# EasyEDA schematic ADS1293.json
TITLE: Sheet_1; REV: 1.0; Date: 2022-02-10; Sheet: 1/1; Drawn By: imamjheimam27; Company: Your Company
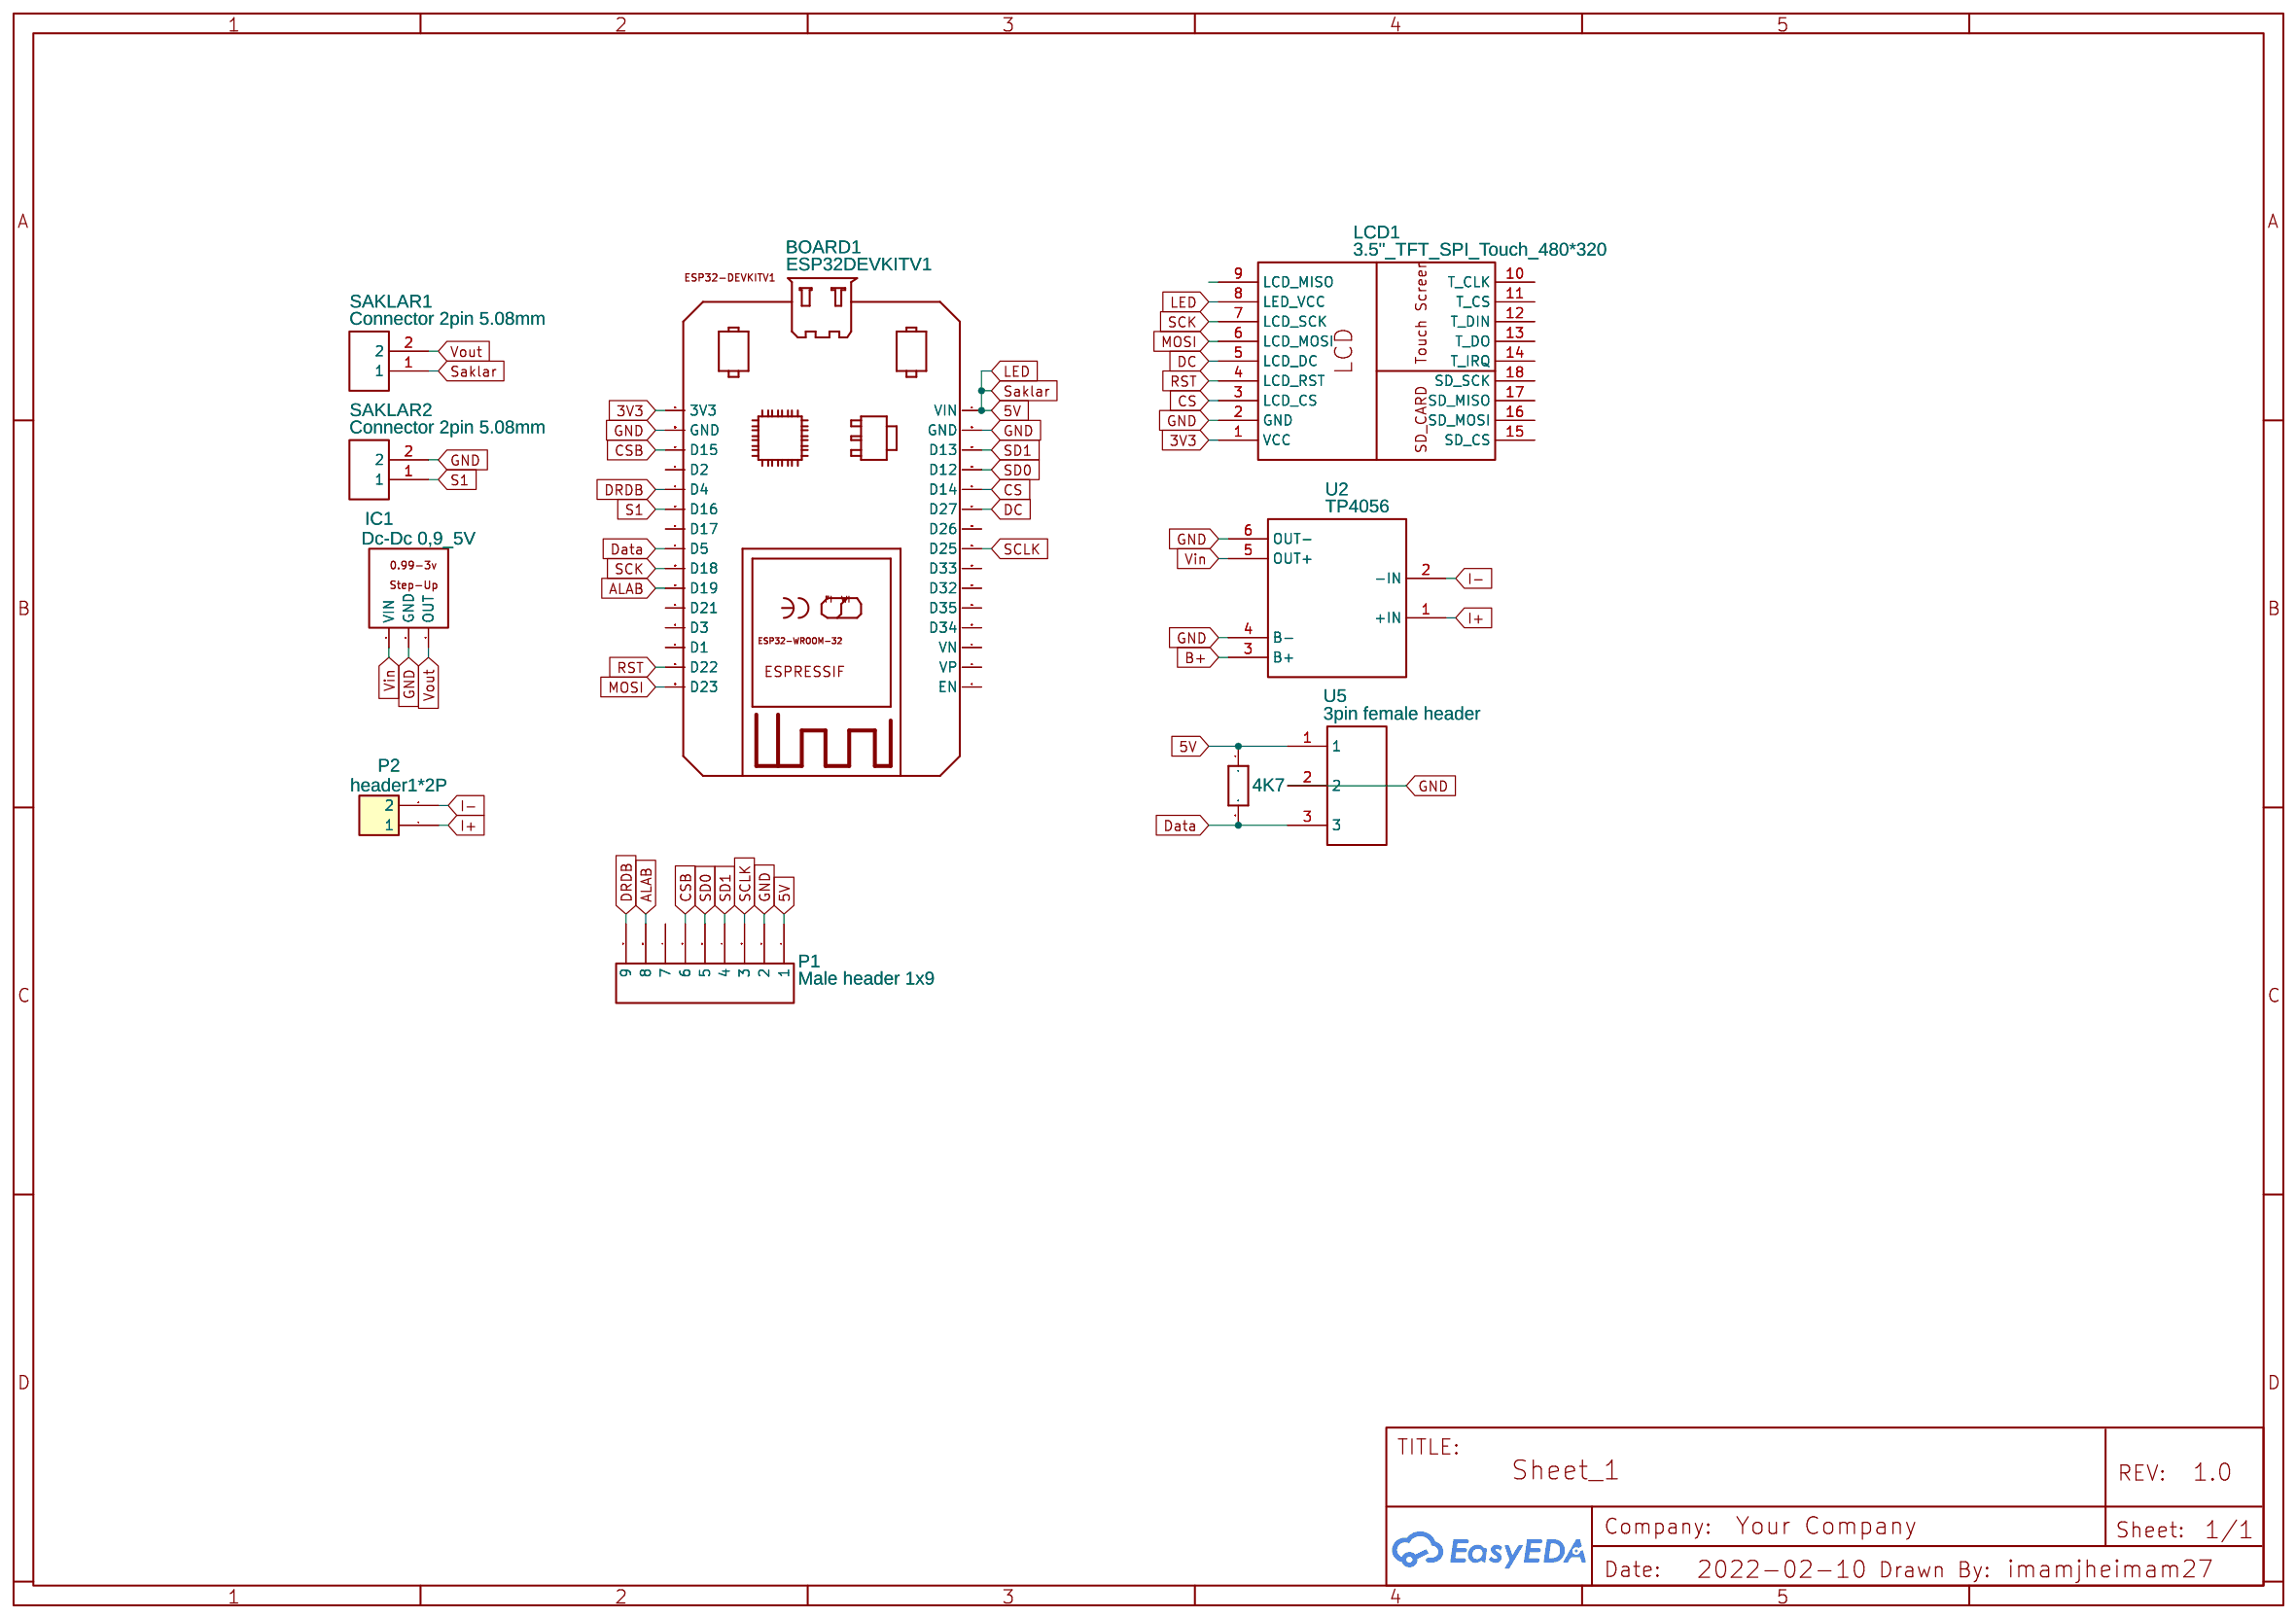
[diagram p0: schematic sheet]

## Parts
4K7  .  [RESAD1750W63L750D250]
BOARD1  ESP32DEVKITV1  [ESP32-DEVKITV1]
IC1  Dc-Dc 0,9_5V  [DC-DC 0.9_5V]
LCD1  3.5"_TFT_SPI_Touch_480*320  [TOUCHSCREEN ILI9488 3.5" TFT SPI 480X320 V1.0 COPY]
P1  Male header 1x9  [9_PINS_2.54MM_SINGLE_ROW_MALE_HEADERS]
P2  header1*2P  [2PIN-HEADER]
SAKLAR1  Connector 2pin 5.08mm  [CONNECTOR  2PIN 5.08MM]
SAKLAR2  Connector 2pin 5.08mm  [CONNECTOR  2PIN 5.08MM]
U2  TP4056  [TP4056]
U5  3pin female header  [3PIN FEMALE HEADER]

## Library data of the parts
4K7 = NFR25H0002208J: Contributor: mrmagpie
BOARD1 = ESP32DEVKITV1: Contributor: sino
IC1 = Dc-Dc 0,9_5V: Contributor: emiliopisa
LCD1 = 3.5&quot;_TFT_SPI_Touch_480*320: Manufacturer Part: ILI 9488; link: http://www.lcdwiki.com/3.5inch_SPI_Module_ILI9488_SKU:MSP3520; Contributor: Andrei GURSCHI
P1 = Male header 1x9: Manufacturer Part: Pin Header 2.54mm Pitch 11 Pin Female Single Row Right Angle Strip; Mounted: Yes; Contributor: nagasai469
P2 = header1*2P: Contributor: al.levashov
SAKLAR1 SAKLAR2 = Connector 2pin 5.08mm: Contributor: bulyga
U2 = TP4056: Contributor: Manuel Velásquez
U5 = 3pin female header: link: https://a.pololu-files.com/picture/0J880.1200.jpg?97bf8a1d9d7fd4e66a3c71ca1c7a873e; Contributor: stentz

## Nets
3V3: BOARD1.3V3 LCD1.1(VCC)
5V: 4K7.1 BOARD1.VIN LCD1.8(LED_VCC) P1.1 SAKLAR1.1 U5.1
GND: BOARD1.GND BOARD1.GND@1(GND) IC1.2(GND) LCD1.2(GND) P1.2 SAKLAR2.2 U2.4(B-) U2.6(OUT-) U5.2
Vin: IC1.1(VIN) U2.5(OUT+)
ALAB: BOARD1.D19 P1.8
B+: U2.3(B+)
CS: BOARD1.D14 LCD1.3(LCD_CS)
CSB: BOARD1.D15 P1.6
Data: 4K7.2 BOARD1.D5 U5.3
DC: BOARD1.D27 LCD1.5(LCD_DC)
DRDB: BOARD1.D4 P1.9
I+: P2.1 U2.1(+IN)
I-: P2.2 U2.2(-IN)
MOSI: BOARD1.D23 LCD1.6(LCD_MOSI)
RST: BOARD1.D22 LCD1.4(LCD_RST)
S1: BOARD1.D16 SAKLAR2.1
SCK: BOARD1.D18 LCD1.7(LCD_SCK)
SCLK: BOARD1.D25 P1.3
SD0: BOARD1.D12 P1.5
SD1: BOARD1.D13 P1.4
Vout: IC1.3(OUT) SAKLAR1.2

Not connected (* = marked no-connect by the designer): BOARD1 D1 D2 D3 D17 D21 D26 D32 D33 D34 D35 EN VN VP; LCD1 9(LCD_MISO) 10(T_CLK) 11(T_CS) 12(T_DIN) 13(T_DO) 14(T_IRQ) 15(SD_CS) 16(SD_MOSI) 17(SD_MISO) 18(SD_SCK); P1 7
